# EAGLE schematic led_chest (EAGLE 6.1)
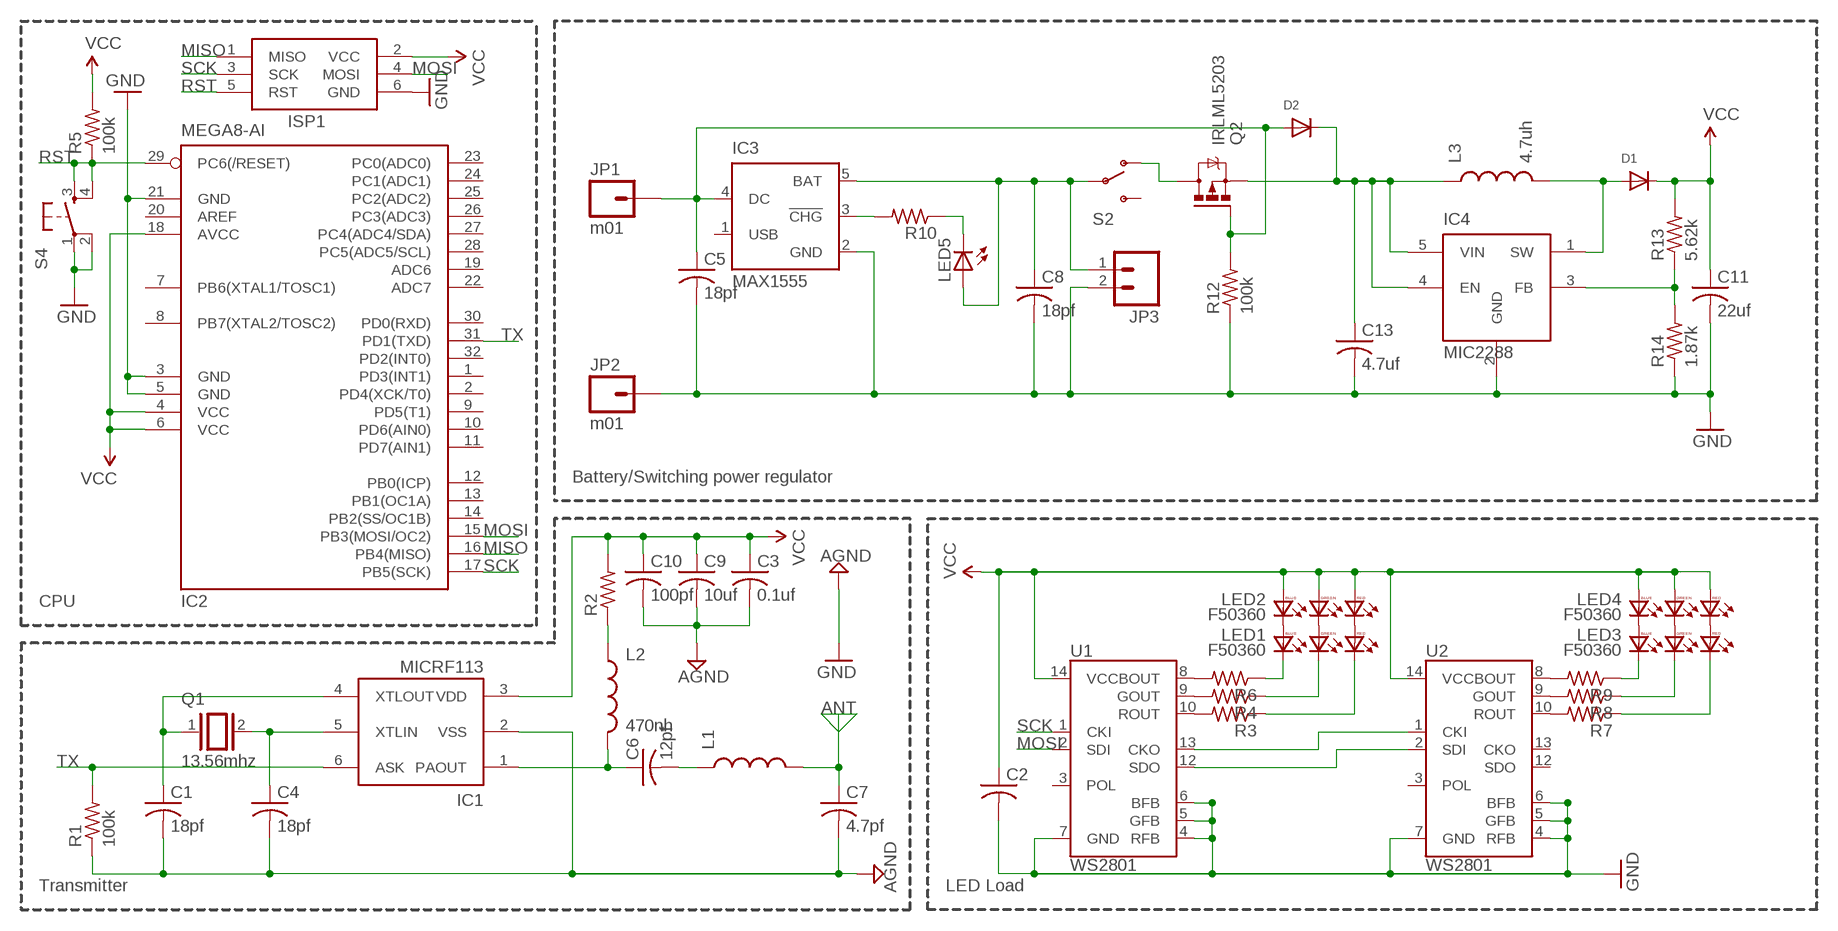
[diagram p0: schematic, sheet 1]

## Parts
C1  18pf  C-USC1206  [C1206]
C2  C-USC1206  [C1206]
C3  0.1uf  C-USC1206  [C1206]
C4  18pf  C-USC1206  [C1206]
C5  18pf  C-USC1206  [C1206]
C6  12pf  C-USC1206  [C1206]
C7  4.7pf  C-USC1206  [C1206]
C8  18pf  C-USC1206  [C1206]
C9  10uf  C-USC1206  [C1206]
C10  100pf  C-USC1206  [C1206]
C11  22uf  C-USC1206  [C1206]
C13  4.7uf  C-USC1206  [C1206]
D1  DIODESOD-123  [SOD-123]
D2  DIODESMA  [SMADIODE]
IC1  MICRF113  [SOT23-6]
IC2  MEGA8-AI  [TQFP32-08]
IC3  MAX1555  [SOT23-5L]
IC4  MIC2288  [SOT23-5]
ISP1  AVRISP-6  [AVRISP]
JP1  m01  M01-SMTSO-256-ET  [SMTSO-256-ET]
JP2  m01  M01-SMTSO-256-ET  [SMTSO-256-ET]
JP3  M02-JST-2MM-SMT  [JST-2-SMD]
L1  INDUCTOR1210  [1210]
L2  470nh  INDUCTOR1210  [1210]
L3  4.7uh  INDUCTOR1210  [1210]
LED1  F50360  [F50360]
LED2  F50360  [F50360]
LED3  F50360  [F50360]
LED4  F50360  [F50360]
LED5  LEDCHIPLED_1206  [CHIPLED_1206]
Q1  13.56mhz  XTAL/S  [QS]
Q2  IRLML5203  [MICRO3]
R1  100k  R-US_R1206  [R1206]
R2  R-US_R1206  [R1206]
R3  R-US_R1206  [R1206]
R4  R-US_R1206  [R1206]
R5  100k  R-US_R1206  [R1206]
R6  R-US_R1206  [R1206]
R7  R-US_R1206  [R1206]
R8  R-US_R1206  [R1206]
R9  R-US_R1206  [R1206]
R10  R-US_R1206  [R1206]
R12  100k  R-US_R1206  [R1206]
R13  5.62k  R-US_R1206  [R1206]
R14  1.87k  R-US_R1206  [R1206]
S2  SWITCH-SPSTSMD2  [SWITCH-SPDT-SMD]
S4  TAC_SWITCHSMD  [TACTILE_SWITCH_SMD]
U1  WS2801  [SOP-14]
U2  WS2801  [SOP-14]

## Nets
AGND: C1.2 C3.2 C4.2 C7.2 C9.2 C10.2 IC1.2(VSS) R1.1 ; supply symbol labelled GND
ANT: C7.1 L1.2
GND: C2.2 C5.2 C8.2 C11.2 C13.2 IC2.3(GND) IC2.5(GND) IC2.21(GND) IC3.2(GND) IC4.2(GND) ISP1.6(GND) JP2.P$1 JP3.2 R12.1 R14.1 S4.1 S4.2 U1.4(RFB) U1.5(GFB) U1.6(BFB) U1.7(GND) U2.4(RFB) U2.5(GFB) U2.6(BFB) U2.7(GND)
MISO: IC2.16(PB4(MISO)) ISP1.1(MISO)
MOSI: IC2.15(PB3(MOSI/OC2)) ISP1.4(MOSI) U1.2(SDI)
N$1: L2.1 R2.1
N$2: R3.2 U1.10(ROUT)
N$3: U1.13(CKO) U2.1(CKI)
N$4: U1.12(SDO) U2.2(SDI)
N$5: C1.1 IC1.4(XTLOUT) Q1.1
N$6: C4.1 IC1.5(XTLIN) Q1.2
N$7: R4.2 U1.9(GOUT)
N$8: R6.2 U1.8(BOUT)
N$9: C6.1 IC1.1(PAOUT) L2.2
N$10: LED1.BC R6.1
N$11: C6.2 L1.1
N$12: LED1.GC R4.1
N$13: LED3.BA LED4.BC
N$14: LED3.GA LED4.GC
N$15: LED1.BA LED2.BC
N$16: LED1.GA LED2.GC
N$17: LED1.RA LED2.RC
N$18: LED3.RA LED4.RC
N$19: LED3.BC R9.1
N$20: LED3.GC R8.1
N$21: LED1.RC R3.1
N$22: LED3.RC R7.1
N$23: R9.2 U2.8(BOUT)
N$24: R8.2 U2.9(GOUT)
N$25: R7.2 U2.10(ROUT)
N$26: Q2.3(D) S2.1(O)
N$27: IC3.3(!CHG) R10.2
N$28: LED5.C R10.1
N$30: D1.A IC4.1(SW) L3.2
N$31: IC4.3(FB) R13.1 R14.2
PWR: C5.1 D2.A IC3.4(DC) JP1.P$1 Q2.1(G) R12.2
RST: IC2.29(PC6(/RESET)) ISP1.5(RST) R5.1 S4.3 S4.4
SCK: IC2.17(PB5(SCK)) ISP1.3(SCK) U1.1(CKI)
TX: IC1.6(ASK) IC2.31(PD1(TXD)) R1.2
VBATT: C8.1 C13.1 D2.C IC3.5(BAT) IC4.4(EN) IC4.5(VIN) JP3.1 L3.1 LED5.A Q2.2(S) S2.2(P)
VCC: C2.1 C3.1 C9.1 C10.1 C11.1 D1.C IC1.3(VDD) IC2.4(VCC) IC2.6(VCC) IC2.18(AVCC) ISP1.2(VCC) LED2.BA LED2.GA LED2.RA LED4.BA LED4.GA LED4.RA R2.2 R5.2 R13.2 U1.14(VCC) U2.14(VCC)
Unconnected: IC2.1(PD3(INT1)) IC2.2(PD4(XCK/T0)) IC2.7(PB6(XTAL1/TOSC1)) IC2.8(PB7(XTAL2/TOSC2)) IC2.9(PD5(T1)) IC2.10(PD6(AIN0)) IC2.11(PD7(AIN1)) IC2.12(PB0(ICP)) IC2.13(PB1(OC1A)) IC2.14(PB2(SS/OC1B)) IC2.19(ADC6) IC2.20(AREF) IC2.22(ADC7) IC2.23(PC0(ADC0)) IC2.24(PC1(ADC1)) IC2.25(PC2(ADC2)) IC2.26(PC3(ADC3)) IC2.27(PC4(ADC4/SDA)) IC2.28(PC5(ADC5/SCL)) IC2.30(PD0(RXD)) IC2.32(PD2(INT0)) IC3.1(USB) S2.3(S) U1.3(POL) U2.3(POL) U2.12(SDO) U2.13(CKO)

## Notes on the sheet
- Battery/Switching power regulator
- CPU
- Transmitter | LED Load

## Library data of the parts
C1-C11 C13 = adafruit:C-US: CAPACITOR, American symbol
D1 D2 = adafruit:DIODE: Diode SMADIODE - SMA Surface Mount Package 20V 1A Schottky Diode Digikey: 641-1014-6-ND DO-1N4148 - Through Hole Small Current Diode SOD-123 20V 1 A (.5mV Vf) Schottky Diode - Digikey: MBRX120TPMSCT-ND SOD-323 10V 570mA (.38mV Vf, 3ns) Schottky Diode - Digikey: ZLLS410CT-ND SOD-523 30V 30mA Schottky Diode (RB751S-40TE61) - Digikey: RB751S-40TE61CT-ND SOT23-R/W - SOT23 Package (R = Solder Paste/Reflow Ovens, W = Hand-Soldering) BAT54Film 40V 300mA - Digikey: 497-7162-1-ND
IC1 = micrel:MICRF113: 300MHz to 450MHz +10dBm ASK Transmitter in SOT23
IC2 = atmel:MEGA8: MICROCONTROLLER 8 Kbytes FLASH, 1 kbytes SRAM, 512 bytes EEPROM, USART, 6-channel 10 bit ADC, 2-channel 8 bit ADC Pin compatible with Atmega48, ATMega88, ATMega168 Source: avr.lbr; MPN: ATMEGA8-16AU; OC_FARNELL: 9171371; OC_NEWARK: 73M8863
IC3 = maxim:MAX1555: Dual-Input USB/AC Adapter 1-Cell Li+ Battery Chargers Source: http://www.maxim-ic.com .. MAX1551-MAX1555.pdf; MF: MAXIM; MPN: MAX1555EZK+T; OC_FARNELL: 1628222; OC_NEWARK: 59J2761
IC4 = micrel:MIC2288
ISP1 = adafruit:AVRISP: AVR ISP HEADER Standard 6 pin header for AVR programming
JP1 JP2 = sparkfun:M01: Header 1 Standard 1-pin 0.1" header. Use with straight break away headers (SKU : PRT-00116), right angle break away headers (PRT-00553), swiss pins (PRT-00743), machine pins (PRT-00117), and female headers (PRT-00115).
JP3 = sparkfun:M02: Header 2 Standard 2-pin 0.1" header. Use with straight break away headers (SKU : PRT-00116), right angle break away headers (PRT-00553), swiss pins (PRT-00743), machine pins (PRT-00117), and female headers (PRT-00115). Molex polarized connector foot print use with SKU : PRT-08233 with associated crimp pins and housings.
L1-L3 = sparkfun:INDUCTOR: Inductors Basic Inductor/Choke - 0603 and 1206. Footprints are not proven and vary greatly between part numbers.
LED1-LED4 = led:F50360: Full color Z-Power LED RGB P5-II Series Source: http://www.seoulsemicon.co.kr .. F50360.pdf
LED5 = adafruit:LED: LED OSRAM: - CHIPLED LG R971, LG N971, LY N971, LG Q971, LY Q971, LO R971, LY R971 LH N974, LH R974 LS Q976, LO Q976, LY Q976 LO Q996 - Hyper CHIPLED LW Q18S LB Q993, LB Q99A, LB R99A - SideLED LS A670, LO A670, LY A670, LG A670, LP A670 LB A673, LV A673, LT A673, LW A673 LH A674 LY A675 LS A676, LA A676, LO A676, LY A676, LW A676 LS A679, LY A679, LG A679 - Hyper Micro SIDELED® LS Y876, LA Y876, LO Y876, LY Y876 LT Y87S - SmartLED LW L88C, LW L88S LB L89C, LB L89S, LG L890 LS L89K, LO L89K, LY L89K LS L896, LA L896, LO L896, LY L896 - TOPLED LS T670, LO T670, LY T670, LG T670, LP T670 LSG T670, LSP T670, LSY T670, LOP T670, LYG T670 LG T671, LOG T671, LSG T671 LB T673, LV T673, LT T673, LW T673 LH T674 LS T676, LA T676, LO T676, LY T676, LB T676, LH T676, LSB T676, LW T676 LB T67C, LV T67C, LT T67C, LS T67K, LO T67K, LY T67K, LW E67C LS E67B, LA E67B, LO E67B, LY E67B, LB E67C, LV E67C, LT E67C LW T67C LS T679, LY T679, LG T679 LS T770, LO T770, LY T770, LG T770, LP T770 LB T773, LV T773, LT T773, LW T773 LH T774 LS E675, LA E675, LY E675, LS T675 LS T776, LA T776, LO T776, LY T776, LB T776 LHGB T686 LT T68C, LB T68C - Hyper Mini TOPLED® LB M676 - Mini TOPLED Santana® LG M470 LS M47K, LO M47K, LY M47K Source: http://www.osram.convergy.de/
Q1 = special:XTAL/S: CRYSTAL
Q2 = transistor-power:IRLML5203: HEXFET P-Channel Power MOSFET
R1-R10 R12-R14 = adafruit:R-US_: RESISTOR, American symbol
S2 = sparkfun:SWITCH-SPST: SPST Switch Simple slide switch. Spark Fun Electronics SKU : COM-00102
S4 = sparkfun:TAC_SWITCH: Momentary Switch Button commonly used for reset or general input. Spark Fun Electronics SKU : COM-00097
U1 U2 = sparkfun:WS2801: WS2801 3 Channel Constant Current LED Driver with programmable PWM outputs. Datasheet: http://www.sparkfun.com/datasheets/Components/LED/WS2801.pdf